# EAGLE design levitador (EAGLE 7.2.0)
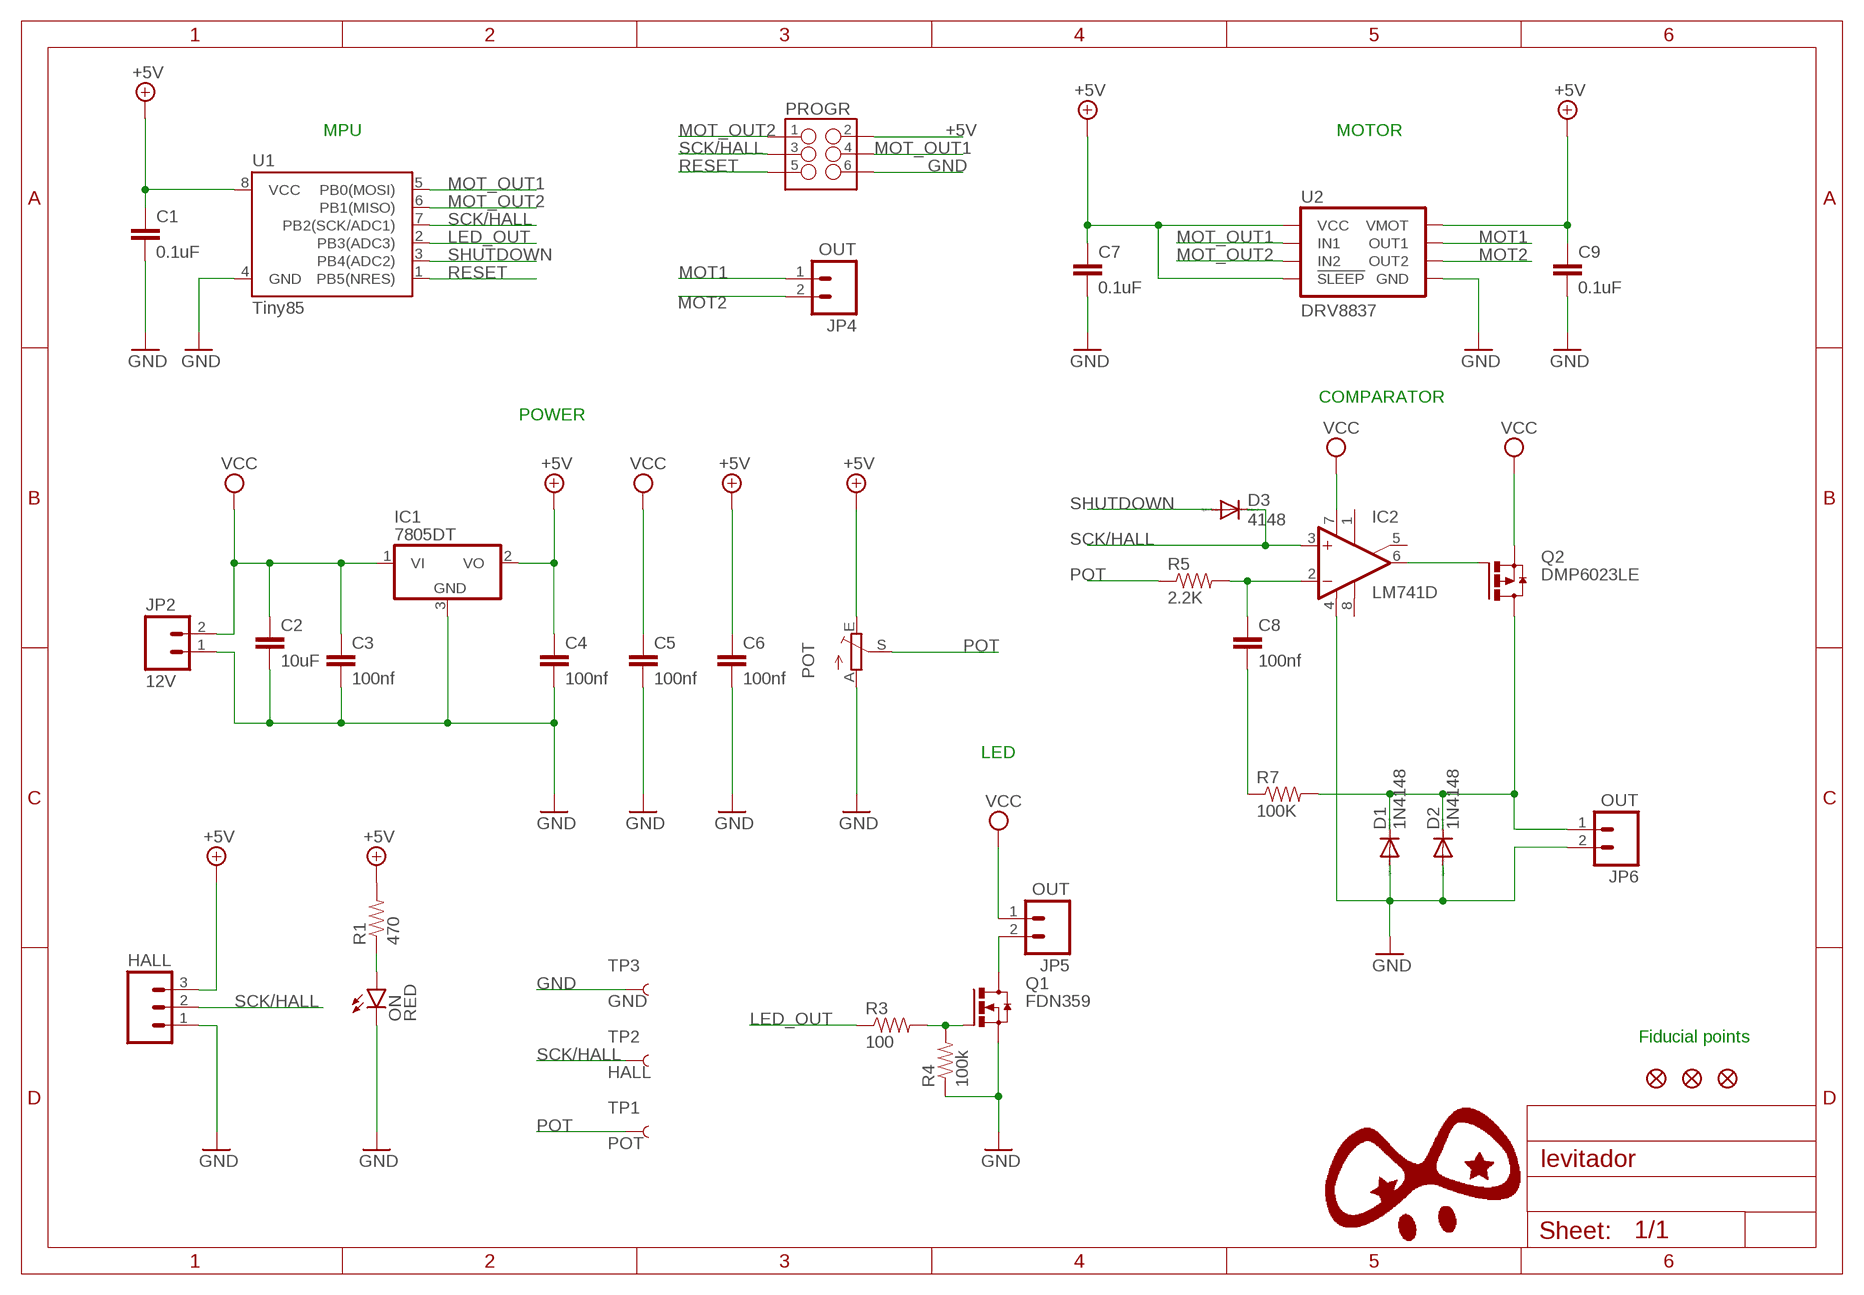
[diagram p0: schematic, sheet 1]

## Parts
C1  0.1uF  0.1UF-16V(+-10%)(0402)  [0402-CAP]
C2  10uF  CAP1206  [1206]
C3  100nf  C-EUC0805  [C0805]
C4  100nf  C-EUC0805  [C0805]
C5  100nf  C-EUC0805  [C0805]
C6  100nf  C-EUC0805  [C0805]
C7  0.1uF  0.1UF-16V(+-10%)(0402)  [0402-CAP]
C8  100nf  C-EUC0805  [C0805]
C9  0.1uF  0.1UF-16V(+-10%)(0402)  [0402-CAP]
D1  1N4148  DIODE-MINIMELF  [MINIMELF]
D2  1N4148  DIODE-MINIMELF  [MINIMELF]
D3  4148  DIODE-MICROMELF-W  [MICROMELF-W]
FID1  FIDUCIAL1X2  [FIDUCIAL-1X2]
FID2  FIDUCIAL1X2  [FIDUCIAL-1X2]
FID3  FIDUCIAL1X2  [FIDUCIAL-1X2]
HALL  M03LOCK  [1X03_LOCK]
IC1  7805DT  [TO252]
IC2  LM741D  [SO08]
JP2  12V  M02POLAR  [MOLEX-1X2]
JP4  OUT  M02POLAR  [MOLEX-1X2]
JP5  OUT  M02POLAR  [MOLEX-1X2]
JP6  OUT  M02POLAR  [MOLEX-1X2]
ON  RED  LED-RED0603  [LED-0603]
POT  TRIM_EU-B64W  [B64W]
PROGR  M03X2  [2X3_SMD]
Q1  FDN359  [SUPER-SOT3]
Q2  DMP6023LE  [SOT223]
R1  470  RESISTOR0805-RES  [0805]
R3  100  RESISTOR0805-RES  [0805]
R4  100k  RESISTOR0805-RES  [0805]
R5  2.2K  RESISTOR0805-RES  [0805]
R7  100K  RESISTOR0805-RES  [0805]
TP1  POT  TEST-POINTTP_15TH_THRU  [TP_15TH]
TP2  HALL  TEST-POINTTP_15TH_THRU  [TP_15TH]
TP3  GND  TEST-POINTTP_15TH_THRU  [TP_15TH]
U1  Tiny85  ATTINY45TINY45-20-SMT  [SO08-EIAJ]
U2  DRV8837  [DSG]

## Nets
+5V: C1.1 C4.1 C6.1 C7.1 C9.1 HALL.3 IC1.2(VO) POT.E PROGR.2 R1.2 U1.8(VCC) U2.1(VMOT) U2.7(!SLEEP) U2.8(VCC)
GND: C1.2 C2.2 C3.2 C4.2 C5.2 C6.2 C7.2 C9.2 D1.A D2.A HALL.1 IC1.3(GND) IC2.4(V-) JP2.1 JP6.2 ON.C POT.A PROGR.6 Q1.2(S) R4.1 TP3.P$1 U1.4(GND) U2.4(GND) U2.PAD(GND)
LED_OUT: R3.1 U1.2(PB3(ADC3))
MOT1: JP4.1 U2.2(OUT1)
MOT2: JP4.2 U2.3(OUT2)
MOT_OUT1: PROGR.4 U1.5(PB0(MOSI)) U2.6(IN1)
MOT_OUT2: PROGR.1 U1.6(PB1(MISO)) U2.5(IN2)
N$2: C8.2 R7.1
N$3: ON.A R1.1
N$4: C8.1 IC2.2(-IN) R5.2
N$5: Q1.1(G) R3.2 R4.2
N$6: JP5.2 Q1.3(D)
N$7: D1.C D2.C JP6.1 Q2.2(D) Q2.4(D) R7.2
N$8: IC2.6(OUT) Q2.1(G)
POT: POT.S R5.1 TP1.P$1
RESET: PROGR.5 U1.1(PB5(NRES))
SCK/HALL: D3.C HALL.2 IC2.3(+IN) PROGR.3 TP2.P$1 U1.7(PB2(SCK/ADC1))
SHUTDOWN: D3.A U1.3(PB4(ADC2))
VCC: C2.1 C3.1 C5.1 IC1.1(VI) IC2.7(V+) JP2.2 JP5.1 Q2.3(S)
Unconnected: IC2.1(ON1) IC2.5(ON2) IC2.8(OPT)

## Notes on the sheet
- MPU | MOTOR
- COMPARATOR
- POWER
- LED
- Fiducial points

## Library data of the parts
C1 C7 C9 = SparkFun-Capacitors:0.1UF-16V(+-10%)(0402); PROD_ID: CAP-12416
C2 = SparkFun-Capacitors:CAP: Capacitor Standard 0603 ceramic capacitor, and 0.1" leaded capacitor.
C3-C6 C8 = rcl:C-EU: CAPACITOR, European symbol
D1-D3 = diode:DIODE-: DIODE
FID1-FID3 = SparkFun-Aesthetics:FIDUCIAL: Fiducial Alignment Points Various fiducial points for machine vision alignment.
HALL = SparkFun-Connectors:M03: Header 3 Standard 3-pin 0.1" header. Use with straight break away headers (SKU : PRT-00116), right angle break away headers (PRT-00553), swiss pins (PRT-00743), machine pins (PRT-00117), and female headers (PRT-00115). Molex polarized connector foot print use with SKU : PRT-08232 with associated crimp pins and housings.
IC1 = linear:78*: Positive VOLTAGE REGULATOR Source: http://cache.national.com/ds/LM/LM78L05.pdf http://www.fairchildsemi.com/ds/LM/LM7805.pdf
IC2 = linear:*741: OP AMP
JP2 JP4-JP6 = SparkFun-Connectors:M02: Standard 2-pin 0.1" header. Use with - straight break away headers ( PRT-00116) - right angle break away headers (PRT-00553) - swiss pins (PRT-00743) - machine pins (PRT-00117) - female headers (PRT-00115) Molex polarized connector foot print use with: PRT-08233 with associated crimp pins and housings. 2.54_SCREWTERM for use with PRT-10571. 3.5mm Screw Terminal footprints for PRT-08084 5mm Screw Terminal footprints for use with PRT-08432
ON = SparkFun-LED:LED-RED: Assorted Red LEDs LilyPad 1206- DIO-09912 1206- DIO-00809 0603- DIO-00819; PROD_ID: DIO-00819
POT = pot:TRIM_EU-: POTENTIOMETER
PROGR = SparkFun-Connectors:M03X2: 2x3 .1" header. Shrouded, with keying- CONN-10681 SMT- CONN-11415 Pogo pins- HW-11044; PROD_ID: CONN-11290
Q1 = transistor-power:FDN359
Q2 = transistor-power:DMP6023LE
R1 R3-R5 R7 = SparkFun-Resistors:RESISTOR: Resistor Basic schematic elements and footprints for 0603, 1206, and PTH resistors.
TP1-TP3 = SparkFun-Passives:TEST-POINT: Bare copper test points for troubleshooting or ICT
U1 = SparkFun-DigitalIC:ATTINY45: Atmel 8-pin 2/4/8kB flash uC; PROD_ID: IC-08922; VALUE: Tiny45-20-SMT
U2 = packages(ti):DRV8837

## Board
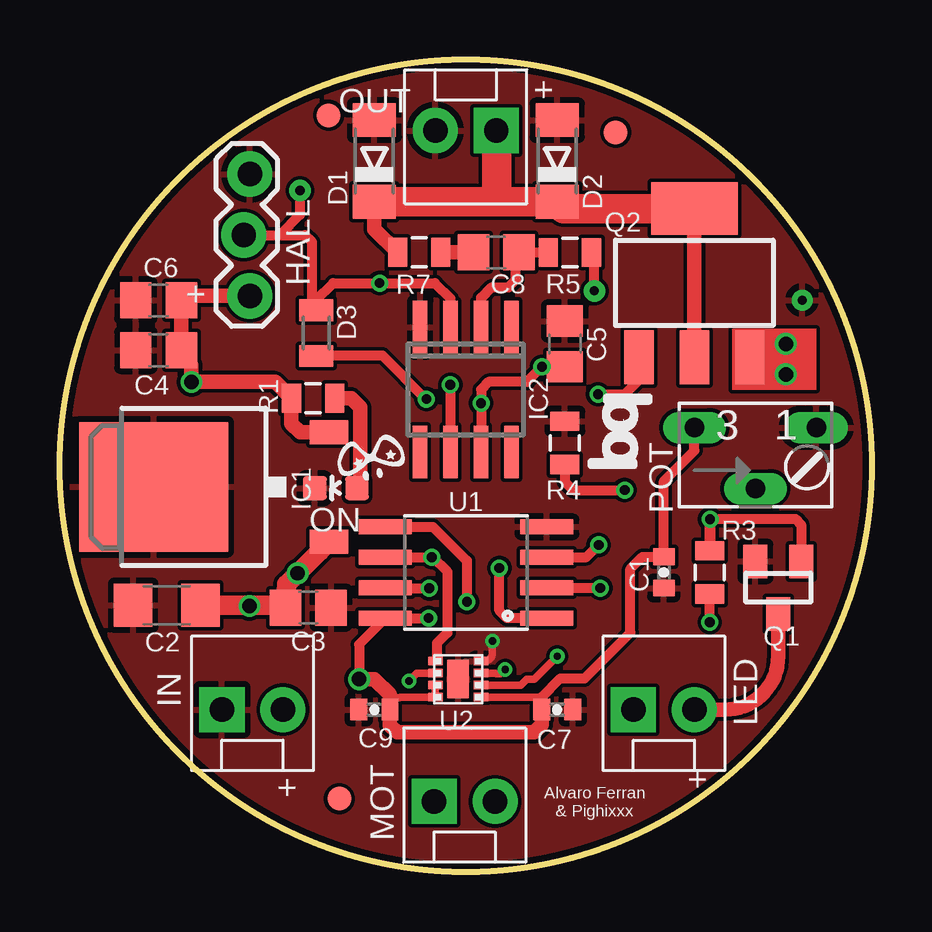
[diagram p1: board, top side]
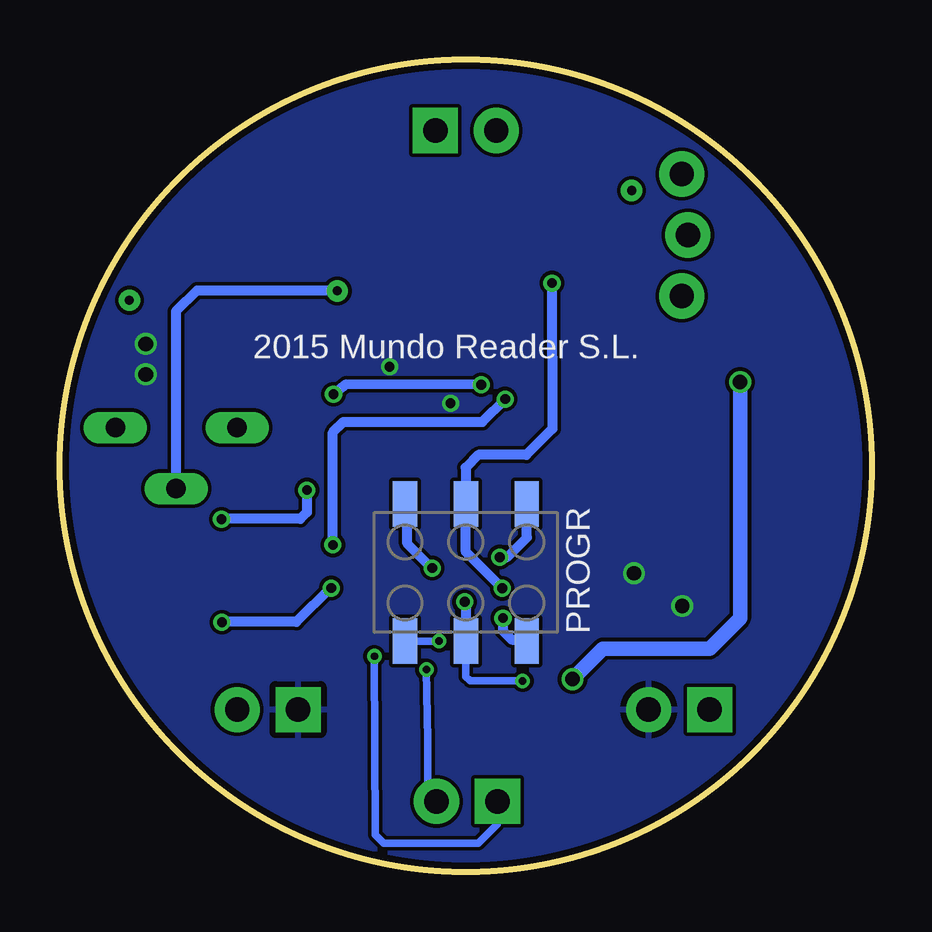
[diagram p2: board, bottom side, seen from below]

Size 33.82 x 33.82 mm. Coordinates in mm from the lower left corner, seen from the top.
Outline: circle at 16.91,16.91 radius 16.91
Copper layers (1*16): Top 0.035mm / dielectric 1.5mm / Bottom 0.035mm
Design rules "pighixxx_CAM_DRC_V1.0": minimum track width 6mil, minimum drill 12mil, track to track 6mil, track to pad 6mil, pad to pad 6mil, via to via 6mil, smd to smd 0mil, copper to edge 10mil, drill to drill 10mil, minimum pad ring 10mil, minimum via ring 6mil, stop-mask expansion 2mil, vias tented up to drill 100mil, thermal gap 10mil

### Footprints (pad centres in the part's own frame; a part is rotated, then mirrored left to right if it is on the bottom)
0402-CAP = smd 0.7 x 0.9: 1 -0.65,0; 2 0.65,0
1206 = smd 1.6 x 1.8: 1 -1.4,0; 2 1.4,0
C0805 = smd 1.3 x 1.5: 1 -0.95,0; 2 0.95,0
MINIMELF = smd 1.4 x 1.8: A 1.7,0; C -1.7,0
MICROMELF-W = smd 0.9 x 1.4: A 0.95,0; C -0.95,0
FIDUCIAL-1X2 = smd 1 x 1: 1 0,0
1X03_LOCK = drill 1.016 pad 1.88: 1 0,0.127; 2 2.54,-0.127; 3 5.08,0.127
TO252 = smd 1 x 1.6: 1 -2.28,-4.8; 2 2.28,-4.8 | smd 5.4 x 6.2: 3 0,2.5
SO08 = smd 0.6 x 2.2: 1 -1.905,-2.6; 2 -0.635,-2.6; 3 0.635,-2.6; 4 1.905,-2.6; 5 1.905,2.6; 6 0.635,2.6; 7 -0.635,2.6; 8 -1.905,2.6
MOLEX-1X2 = drill 1.016 pad 1.88 square: 1 0,0 | drill 1.016 pad 1.88: 2 2.54,0
LED-0603 = smd 1 x 1: A 0,-0.877; C 0,0.877
B64W = drill 0.813 long: A 2.54,0; E -2.54,0; S 0,-2.54
2X3_SMD = smd 1.02 x 1.9: 1 -2.54,-2.85; 2 -2.54,2.85; 3 0,-2.85; 4 0,2.85; 5 2.54,-2.85; 6 2.54,2.85
SUPER-SOT3 = smd 1 x 1.4: 1 -0.95,-1.1; 2 0.95,-1.1; 3 0,1.1
SOT223 = smd 1.219 x 2.235: 1 -2.311,-3.099; 2 0,-3.099; 3 2.311,-3.099 | smd 3.6 x 2.2: 4 0,3.099
0805 = smd 0.8 x 1.2: 1 -0.9,0; 2 0.9,0
TP_15TH = drill 0.381 pad 0.61: P$1 0,0
SO08-EIAJ = smd 0.61 x 2.21: 1 -1.905,-3.378; 2 -0.635,-3.378; 3 0.635,-3.378; 4 1.905,-3.378; 5 1.905,3.353; 6 0.635,3.353; 7 -0.635,3.353; 8 -1.905,3.353
DSG = smd 0.6 x 0.35: 1 -0.95,0.75; 2 -0.95,0.25; 3 -0.95,-0.25; 4 -0.95,-0.75; 5 0.95,-0.75; 6 0.95,-0.25; 7 0.95,0.25; 8 0.95,0.75 | smd 0.9 x 1.6: PAD 0,0

### Placement (x,y rotation side)
C1  25.16,12.46 270 top
C2  4.45,11.1 180 top
C3  10.34,11 0 top
C4  4.11,21.72 180 top
C5  21.04,21.99 90 top
C6  4.11,23.8 180 top
C7  20.72,6.75 0 top
C8  18.18,25.8 180 top
C9  13.1,6.75 180 top
D1  13.1,29.61 90 top
D2  20.72,29.61 90 top
D3  10.68,22.44 270 top
FID1  11.19,31.51 0 top
FID2  11.65,3.04 0 top
FID3  23.15,30.8 270 top
HALL  7.78,29.06 270 top
IC1  6.41,16.03 90 top
IC2  16.91,20.08 180 top
JP2  6.75,6.75 0 top
JP4  15.59,2.93 0 top
JP5  23.89,6.75 0 top
JP6  18.18,30.88 180 top
ON  11.5,15.98 90 top
POT  28.97,18.5 0 top
PROGR  16.91,12.46 180 bottom
Q1  29.93,11.83 180 top
Q2  26.43,24.53 0 top
R1  10.54,19.73 180 top
R3  27.07,12.46 90 top
R4  21.04,17.86 270 top
R5  21.24,25.79 180 top
R7  14.97,25.8 180 top
TP1  22.26,24.2 0 top
TP2  10,28.38 0 top
TP3  30.93,23.81 0 top
U1  16.91,12.46 90 top
U2  16.59,8.02 180 top

### Tracks (layer width: path | path; a pad name or v marks a point on that pad's centre or on a via)
+5V  (via drill 0.41, 0.61)
  Top 0.305: 20.07,7.27 U2.1 | C9.1 arc-90 14.27,7.27 U2.8 U2.7
  Top 0.406: v12.46,8.02 12.46,9.47 U1.8 v15.36,10.56 | POT.E 26.43,17.54 25.16,16.27 C1.1 24.26,13.11 23.77,12.61 23.77,9.95 21.86,8.05 20.85,8.05 20.07,7.27 C7.1
  Top 0.61: v12.46,8.02 13.1,8.02 13.73,7.38 13.73,6.76 C9.1 13.75,6.1 14.05,5.8 19.77,5.8 20.08,6.11 20.08,6.73 C7.1 | 4.82,23.98 5.24,23.98 | HALL.3 5.34,23.98 5.24,23.98 | IC1.2 10,18.31 9.64,18.67 R1.2 8.97,20.4 v5.48,20.4 5.48,21.1 5.06,21.52 C4.1 | C4.1 | C4.1 C6.1 5.24,23.98
  Bottom 0.406: v15.36,10.56 15.36,10.02 15,9.67 14.42,9.67 PROGR.2
  Bottom 0.61: v5.48,20.4 5.48,10.56 6.75,9.29 11.19,9.29 v12.46,8.02
GND  (via drill 0.3)
  Top 0.305: U2.4 17.66,8.77 arc90 18.02,9.13 v18.02,9.61
  Bottom 0.305: v18.02,9.61 PROGR.6 arc90 PROGR.6
  pour Top: -0.87,16.91 arc90 16.91,-0.87 18.18,-0.87 arc94 34.69,16.91 arc79 17.54,34.69 arc101
LED_OUT  (via drill 0.41)
  Top 0.406: U1.2 22.5,11.83 v22.51,11.81 | v27.07,10.39 R3.1
  Bottom 0.406: v22.51,11.81 22.56,11.81 23.97,10.4 27.06,10.4 v27.07,10.39
MOT1  (via drill 0.3)
  Top 0.305: U2.2 19.2,7.77 19.45,8.02 19.77,8.02 v20.72,8.97
  Bottom 0.305: v20.72,8.97 20.69,1.53 20.33,1.18 16.39,1.18 15.59,1.97 JP4.1
MOT2  (via drill 0.3)
  Top 0.305: 17.79,8.27 U2.3 18.11,8.27 arc90 v18.55,8.42
  Bottom 0.305: v18.55,8.42 18.5,5.48 18.5,3.3 JP4.2
MOT_OUT1  (via drill 0.3, 0.41)
  Top 0.305: U2.6 14.87,8.27 v14.54,7.94
  Top 0.406: U1.5 15.54,14.37 16.96,12.95 v16.96,11.24
  Bottom 0.305: v14.54,7.94 16.73,7.94 16.91,8.12 PROGR.4 | PROGR.4
  Bottom 0.406: v16.96,11.24 16.91,11.19 PROGR.4
MOT_OUT2  (via drill 0.41)
  Top 0.305: U2.5 15.71,8.84
  Top 0.406: 15.71,8.84 15.71,9.53 16.11,9.93 16.15,9.93 16.15,12.48 15.53,13.1 v15.49,13.1 U1.6
  Bottom 0.406: v15.49,13.1 15.18,13.1 14.37,13.92 PROGR.1
N$2
  Top 0.61: R7.1 17.28,25.8 C8.2
N$3
  Top 0.61: R1.1 12.13,19.73 12.51,19.34 12.51,16.12 ON.A
N$4
  Top 0.406: IC2.2 17.54,23.92 17.97,24.35 18.69,24.35 19,24.66 19,25.72 C8.1 19.08,25.8 R5.2
N$5  (via drill 0.41)
  Top 0.406: R4.2 21.04,16.25 21.39,15.9 v23.53,15.9 | v27.09,14.68 27.09,13.38 R3.2 27.07,14.66 27.1,14.69 30.65,14.69 30.88,14.46 Q1.1
  Bottom 0.406: v23.53,15.9 23.53,14.96 23.8,14.69 27.07,14.69 v27.09,14.68
N$6
  Top 0.61: JP5.2 27.7,6.75 arc90 29.93,8.97 Q1.3
N$7
  Top 0.61: D1.C 13.1,26.77 R7.2 | Q2.4 Q2.2
  Top 1.219: Q2.4 21,27.63 D2.C 18.19,27.91 | 18.19,27.91 D1.C | JP6.1 18.19,30.86 18.19,27.91
N$8  (via drill 0.41)
  Top 0.406: IC2.6 16.27,20.28 v16.26,20.29 | v22.42,19.89 23.54,19.89 24.16,20.51 24.16,21.39 Q2.1
  Bottom 0.406: v16.26,20.29 21.89,20.3 v22.42,19.89
POT
  Top 0.406: TP1.P$1 22.26,25.67 R5.1
  Bottom 0.406: TP1.P$1 28.12,24.21 28.99,23.34 28.99,15.97 POT.S
RESET  (via drill 0.41)
  Top 0.406: U1.1 18.62,10.56 18.31,10.88 v18.31,12.65
  Bottom 0.406: v18.31,12.65 18.33,12.65 19.34,13.66 19.34,15.21 PROGR.5
SCK/HALL  (via drill 0.41)
  Top 0.406: U1.7 13.58,11.8 v15.39,11.8 | IC2.3 16.27,23.87 15.62,24.52 v13.32,24.52 11.38,24.52 10.68,23.82 D3.C 10.49,23.57 10.49,26.24 10.21,26.52 9.16,26.52 | HALL.2 9.16,26.52 | TP2.P$1 10,27.36 9.16,26.52
  Bottom 0.406: v15.39,11.8 16.91,13.32 PROGR.3 16.91,16.83 16.39,17.36 14.38,17.36 13.3,18.45 v13.32,24.52
SHUTDOWN  (via drill 0.41)
  Top 0.406: U1.3 21.93,13.1 v22.44,13.61 | v15.27,19.69 15.25,19.69 13.44,21.5 D3.A
  Bottom 0.406: v22.44,13.61 22.44,18.3 22,18.74 16.21,18.74 v15.27,19.69
VCC  (via drill 0.41, 0.6, 0.61)
  Top 0.406: C5.1 v20.08,21.04 19.45,20.4 17.86,20.4 17.54,20.08 v17.54,19.52 IC2.7 | 9.39,11.1 C3.1
  Top 0.61: v30.24,21.99 29.3,21.99 Q2.3
  Top 0.813: C3.1 9.44,11.97 v9.9,12.43 10.82,13.35 IC1.1 | C2.1 9.39,11.1
  other vias: 30.24,20.72 7.89,11.06
  pour Bottom: -0.87,16.91 arc90 16.91,-0.87 18.18,-0.87 arc96 34.69,17.54 arc89 13.73,34.69 arc91
(copper drawn outside any net)
  shapes: Top area x1

### Text on the board
tNames: + | OUT | + | IN | LED | MOT | + | + | Alvaro Ferran / & Pighixxx
bNames: 2015 Mundo Reader S.L.